# EAGLE design isolated io booster pack (EAGLE 6.4)
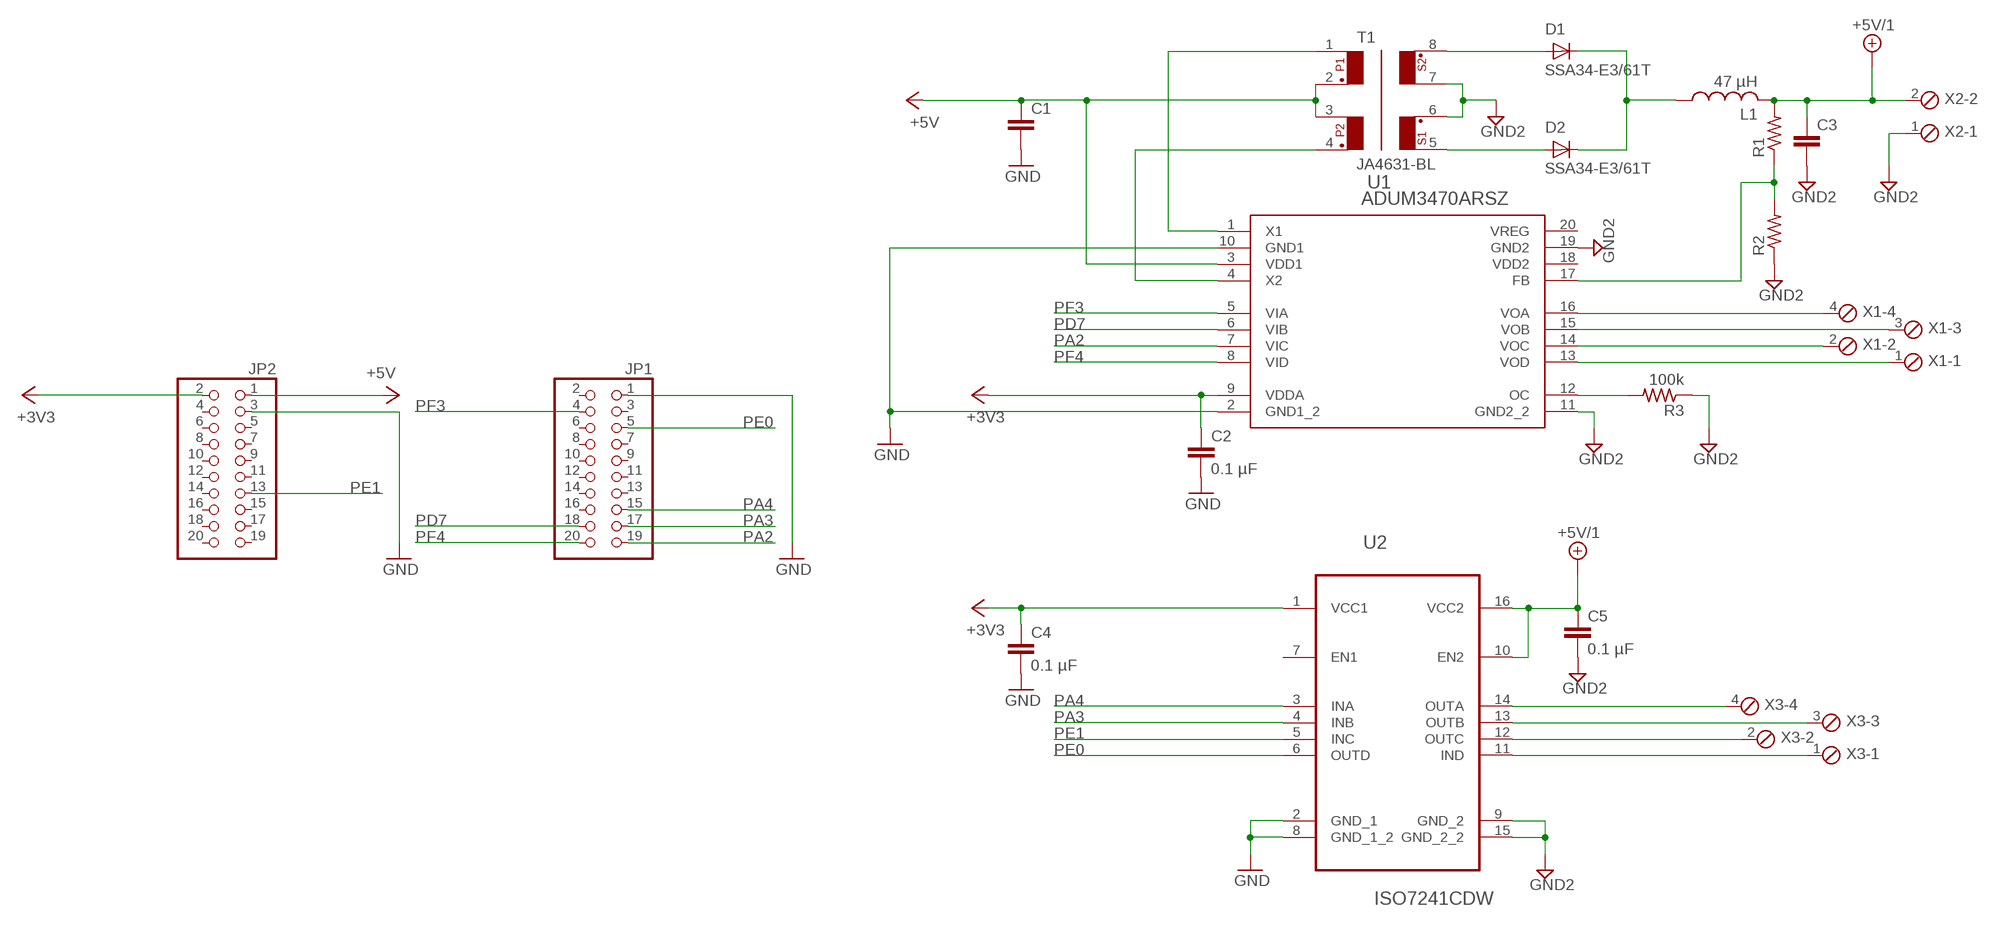
[diagram p0: schematic, sheet 1]

## Parts
C1  C-EUC1210  [C1210]
C2  0.1 µF  C-EUC0805  [C0805]
C3  C-EUC1210  [C1210]
C4  0.1 µF  C-EUC0805  [C0805]
C5  0.1 µF  C-EUC0805  [C0805]
D1  SSA34-E3/61T  GF1  [SMA-DO214AC]
D2  SSA34-E3/61T  GF1  [SMA-DO214AC]
JP1  PINHD-2X10  [2X10]
JP2  PINHD-2X10  [2X10]
L1  47 µH  L-USLPS5030  [LPS5030]
R1  R-US_R0805  [R0805]
R2  R-US_R0805  [R0805]
R3  100k  R-US_R0805  [R0805]
T1  JA4631-BL  [JA4631-BL]
U1  ADUM3470ARSZ  [RS_20]
U2  ISO7241CDW  [SOIC127P1030X265-16N]
X1  MPT4  [4POL254]
X2  MPT2  [2POL254]
X3  MPT4  [4POL254]

## Nets
+3V3: C2.1 C4.1 JP2.2 U1.9(VDDA) U2.1(VCC1)
+5V: C1.1 JP2.1 T1.2 T1.3 U1.3(VDD1)
+5V/1: C3.1 C5.1 L1.2 R1.2 U2.10(EN2) U2.16(VCC2) X2.2
GND: C1.2 C2.2 C4.2 JP1.1 JP2.3 U1.2(GND1_2) U1.10(GND1) U2.2(GND_1) U2.8(GND_1_2)
GND2: C3.2 C5.2 R2.1 R3.1 T1.6 T1.7 U1.11(GND2_2) U1.19(GND2) U2.9(GND_2) U2.15(GND_2_2) X2.1
N$1: U1.16(VOA) X1.4
N$2: D1.A T1.8
N$3: T1.1 U1.1(X1)
N$4: T1.4 U1.4(X2)
N$5: D2.A T1.5
N$6: D1.K(C) D2.K(C) L1.1
N$7: U1.15(VOB) X1.3
N$8: U1.14(VOC) X1.2
N$9: U1.13(VOD) X1.1
N$10: U2.14(OUTA) X3.4
N$11: U2.13(OUTB) X3.3
N$12: U2.12(OUTC) X3.2
N$13: U2.11(IND) X3.1
N$14: R1.1 R2.2 U1.17(FB)
N$15: R3.2 U1.12(OC)
PA2: JP1.19 U1.7(VIC)
PA3: JP1.17 U2.4(INB)
PA4: JP1.15 U2.3(INA)
PD7: JP1.18 U1.6(VIB)
PE0: JP1.5 U2.6(OUTD)
PE1: JP2.13 U2.5(INC)
PF3: JP1.4 U1.5(VIA)
PF4: JP1.20 U1.8(VID)
Unconnected: JP1.2 JP1.3 JP1.6 JP1.7 JP1.8 JP1.9 JP1.10 JP1.11 JP1.12 JP1.13 JP1.14 JP1.16 JP2.4 JP2.5 JP2.6 JP2.7 JP2.8 JP2.9 JP2.10 JP2.11 JP2.12 JP2.14 JP2.15 JP2.16 JP2.17 JP2.18 JP2.19 JP2.20 U1.18(VDD2) U1.20(VREG) U2.7(EN1)

## Library data of the parts
C1-C5 = rcl:C-EU: CAPACITOR, European symbol
D1 D2 = diode:GF1: DIODE
JP1 JP2 = pinhead:PINHD-2X10: PIN HEADER
L1 = inductors:L-US: INDUCTOR, American symbol
R1-R3 = rcl:R-US_: RESISTOR, American symbol
T1 = JA4631-BL:JA4631-BL
U1 = ADuM3470:ADUM3470ARSZ
U2 = ISO7241:ISO7241CDW: HIGH SPEED QUAD DIGITAL ISOLATORS; MPN: ISO7241CDW; OC_FARNELL: 1575372; OC_NEWARK: 73M3155; PACKAGE: SOIC-16; SUPPLIER: TEXAS INSTRUMENTS
X1 X3 = con-phoenix-254:MPT4: PHOENIX CONNECTOR; OC_FARNELL: unknown; OC_NEWARK: unknown
X2 = con-phoenix-254:MPT2: PHOENIX CONNECTOR; OC_FARNELL: unknown; OC_NEWARK: unknown

## Board
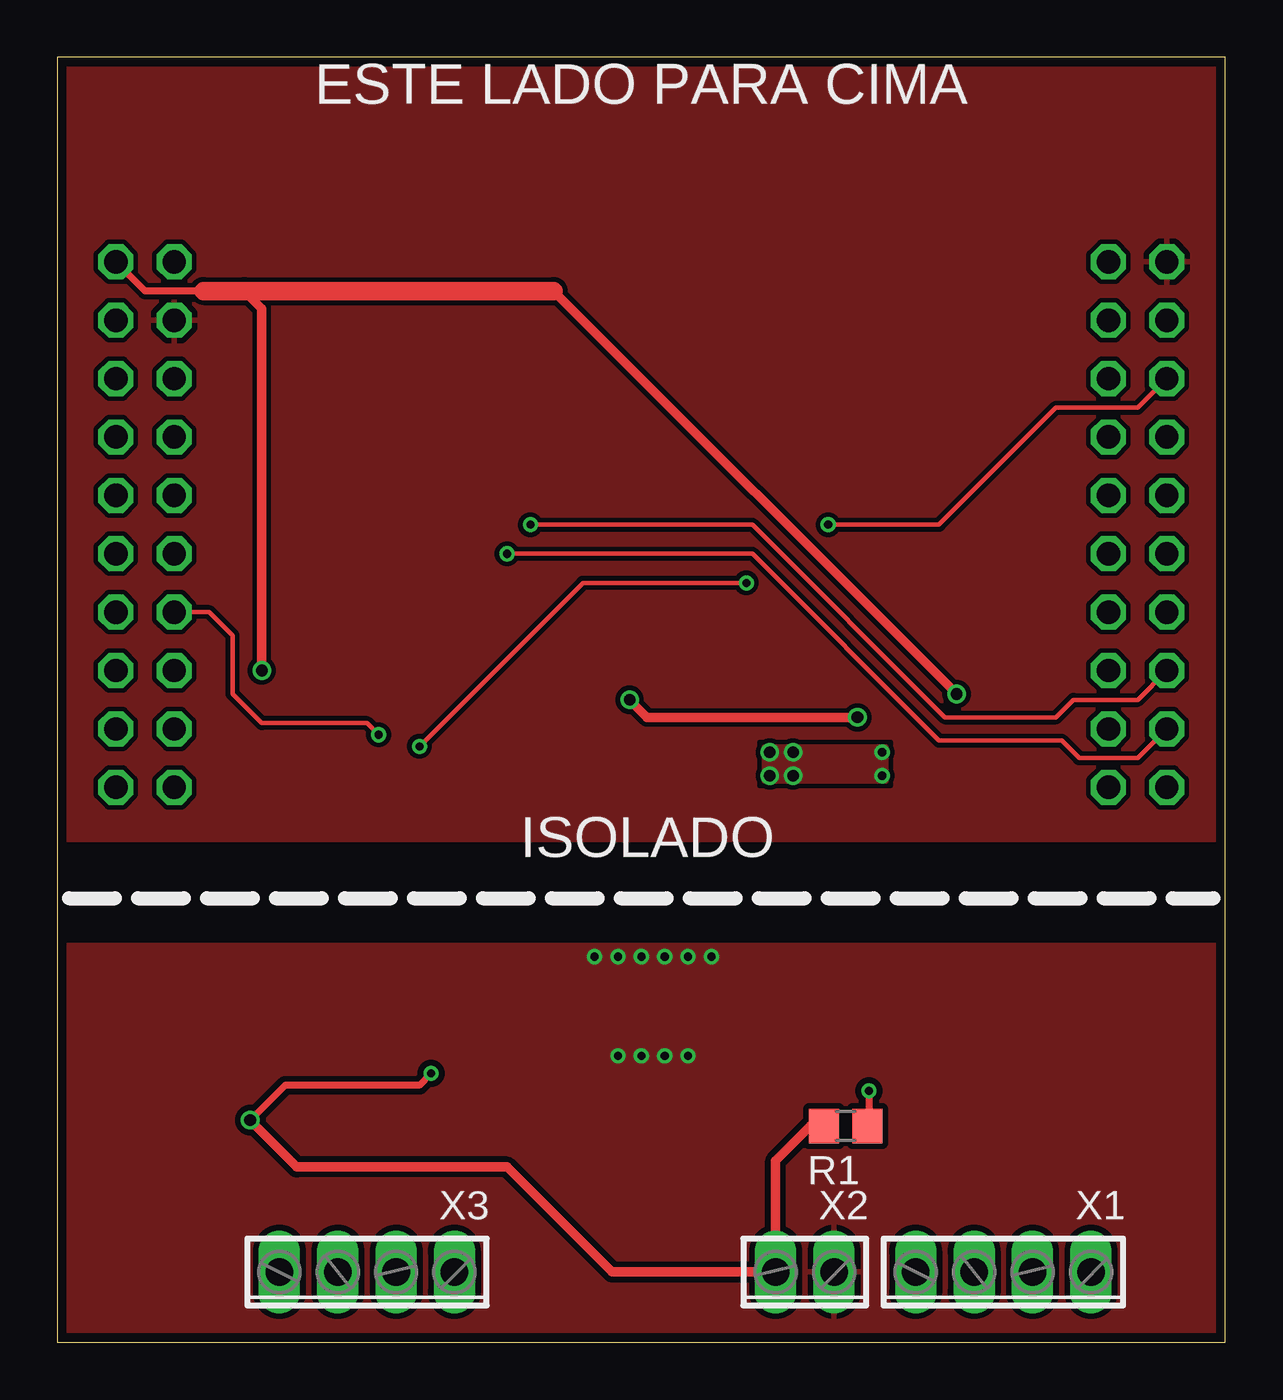
[diagram p1: board, top side]
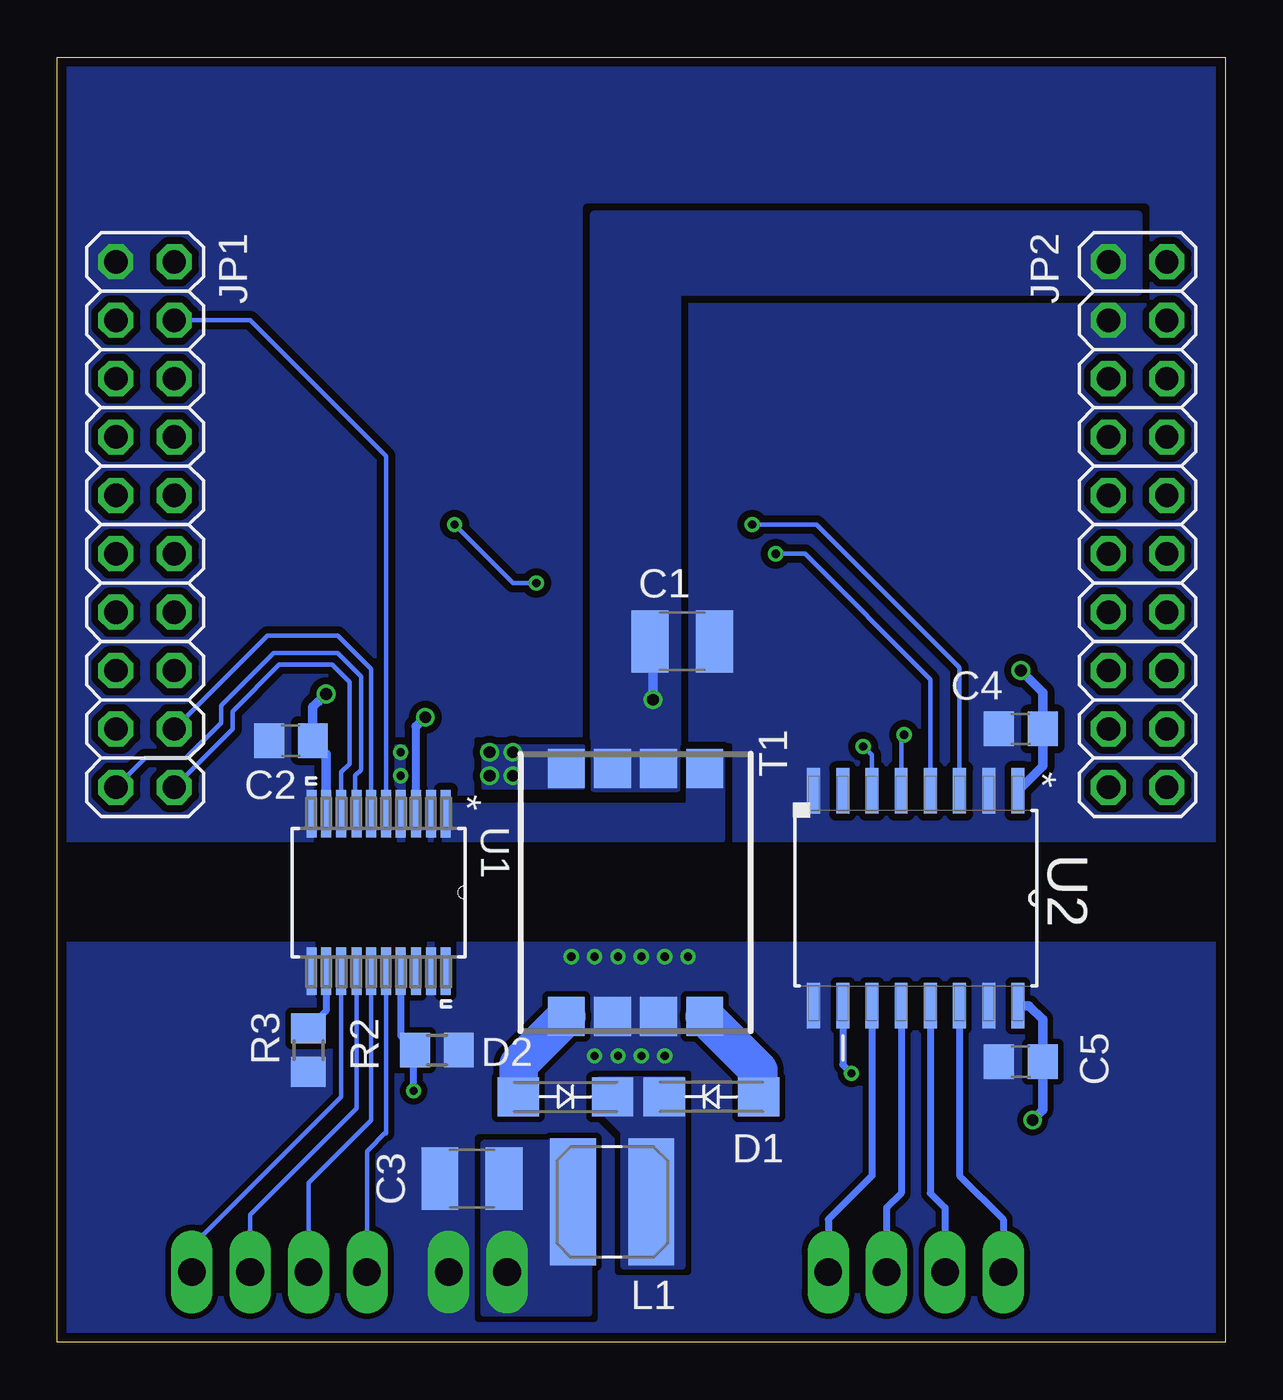
[diagram p2: board, bottom side, seen from below]

Size 50.8 x 55.88 mm. Coordinates in mm from the lower left corner, seen from the top.
Outline: 0,0 50.8,0 50.8,55.88 0,55.88 0,0
Copper layers (1*16): Top 0.035mm / dielectric 1.5mm / Bottom 0.035mm
Design rules "Fusion_eagle_rule_v1.1 *": minimum track width 6mil, minimum drill 12mil, track to track 6mil, track to pad 6mil, pad to pad 6mil, via to via 6mil, smd to smd 0mil, copper to edge 16mil, drill to drill 10mil, minimum pad ring 10mil, minimum via ring 6mil, stop-mask expansion 2mil, vias tented up to drill 100mil, thermal gap 10mil

### Footprints (pad centres in the part's own frame; a part is rotated, then mirrored left to right if it is on the bottom)
C1210 = smd 1.6 x 2.7: 1 -1.4,0; 2 1.4,0
C0805 = smd 1.3 x 1.5: 1 -0.95,0; 2 0.95,0
SMA-DO214AC = smd 1.8 x 1.7: A -2.05,0; K 2.05,0
2X10 = drill 1.016 octagon: 1 -11.43,-1.27; 2 -11.43,1.27; 3 -8.89,-1.27; 4 -8.89,1.27; 5 -6.35,-1.27; 6 -6.35,1.27; 7 -3.81,-1.27; 8 -3.81,1.27; 9 -1.27,-1.27; 10 -1.27,1.27; 11 1.27,-1.27; 12 1.27,1.27; 13 3.81,-1.27; 14 3.81,1.27; 15 6.35,-1.27; 16 6.35,1.27; 17 8.89,-1.27; 18 8.89,1.27; 19 11.43,-1.27; 20 11.43,1.27
LPS5030 = smd 1.995 x 5.51: 1 -1.7,0; 2 1.7,0
R0805 = smd 1.3 x 1.5: 1 -0.95,0; 2 0.95,0
JA4631-BL = smd 1.702 x 1.6: 1 -5.397,3.01; 2 -5.397,1.003; 3 -5.397,-1.003; 4 -5.397,-3.01; 5 5.397,-3.01; 6 5.397,-1.003; 7 5.397,1.003; 8 5.397,3.01
RS_20 = smd 2.057 x 0.432: 1 -3.429,2.921; 2 -3.429,2.286; 3 -3.429,1.626; 4 -3.429,0.965; 5 -3.429,0.33; 6 -3.429,-0.33; 7 -3.429,-0.965; 8 -3.429,-1.626; 9 -3.429,-2.286; 10 -3.429,-2.921; 11 3.429,-2.921; 12 3.429,-2.286; 13 3.429,-1.626; 14 3.429,-0.965; 15 3.429,-0.33; 16 3.429,0.33; 17 3.429,0.965; 18 3.429,1.626; 19 3.429,2.286; 20 3.429,2.921
SOIC127P1030X265-16N = smd 1.981 x 0.559: 1 -4.674,4.445; 2 -4.674,3.175; 3 -4.674,1.905; 4 -4.674,0.635; 5 -4.674,-0.635; 6 -4.674,-1.905; 7 -4.674,-3.175; 8 -4.674,-4.445; 9 4.674,-4.445; 10 4.674,-3.175; 11 4.674,-1.905; 12 4.674,-0.635; 13 4.674,0.635; 14 4.674,1.905; 15 4.674,3.175; 16 4.674,4.445
4POL254 = drill 1.2 long: 1 -3.81,0; 2 -1.27,0; 3 1.27,0; 4 3.81,0
2POL254 = drill 1.2 long: 1 -1.27,0; 2 1.27,0

### Placement (x,y rotation side)
C1  23.62,30.48 0 bottom
C2  40.64,26.16 180 bottom
C3  32.77,7.11 180 bottom
C4  8.89,26.67 180 bottom
C5  8.89,12.19 180 bottom
D1  22.35,10.67 180 bottom
D2  28.7,10.67 0 bottom
JP1  46.99,35.56 270 bottom
JP2  3.81,35.56 270 bottom
L1  26.67,6.1 180 bottom
R1  34.29,9.4 180 top
R2  34.29,12.7 180 bottom
R3  39.88,12.7 90 bottom
T1  25.65,19.56 270 bottom
U1  36.83,19.56 270 bottom
U2  13.46,19.3 270 bottom
X1  41.15,3.05 180 top
X2  32.51,3.05 180 top
X3  13.46,3.05 180 top

### Tracks (layer width: path | path; a pad name or v marks a point on that pad's centre or on a via)
+3V3  (via drill 0.51)
  Top 0.305: 6.35,45.72 3.81,45.72 JP2.2
  Top 0.406: v39.12,28.19 21.59,45.72 | v8.89,29.21 8.89,44.96 8.13,45.72
  Top 0.813: 6.35,45.72 8.13,45.72 21.59,45.72
  Bottom 0.406: 39.44,27.87 v39.12,28.19 39.69,27.62 C2.1 39.12,25.59 U1.9 | U2.1 7.94,25.05 C4.1 7.94,28.26 v8.89,29.21
+5V  (via drill 0.51)
  Top 0.406: v34.8,27.18 25.65,27.18 v24.89,27.94
  Bottom 0.356: U1.3 35.2,26.77
  Bottom 0.406: 35.2,26.77 v34.8,27.18 | v24.89,27.94 24.89,29.46
  pour Bottom (isolate 0.254, rank 2, no thermals): 27.43,24.13 27.43,49.02 3.81,49.02 3.81,45.72 23.88,45.72 23.88,24.13
+5V/1  (via drill 0.36, 0.51)
  Top 0.305: v8.38,9.65 9.91,11.18 15.75,11.18 v16.26,11.68
  Top 0.406: v8.38,9.65 10.41,7.62 19.56,7.62 24.13,3.05 X2.2 31.24,7.87 32.77,9.4 R1.2
  Bottom 0.305: U2.10 16.64,12.06 v16.26,11.68
  Bottom 0.406: U2.16 8.53,14.63 7.94,14.04 C5.1 7.94,10.09 v8.38,9.65
  pour Bottom (isolate 0.254, no thermals): 27.69,8.64 32.26,8.64 32.26,1.27 27.69,1.27
GND
  pour Top (isolate 0.203, rank 6): 0,21.84 50.8,21.84 50.8,55.88 0,55.88
  pour Bottom (isolate 0.305, rank 6, no thermals): 0,21.84 50.8,21.84 50.8,55.88 0,55.88
GND2  (via drill 0.36)
  other vias: 23.37,16.76 24.38,16.76 25.4,16.76 26.42,16.76 27.43,16.76 28.45,16.76 24.38,12.45 25.4,12.45 26.42,12.45 27.43,12.45
  pour Top (isolate 0.254, rank 6): 0,0 50.8,0 50.8,17.02 50.8,17.27 0,17.27
  pour Bottom (isolate 0.254, rank 6, no thermals): 0,0 50.8,0 50.8,17.02 50.8,17.27 0,17.27
N$1
  Bottom 0.203: U1.16 36.5,9.14 | 36.5,9.14 36.5,9.07 | X1.4 37.34,8.31 36.5,9.14
N$2
  Bottom 1.422: 22.61,14.12 T1.8
  Bottom 1.676: D1.A 20.3,11.82 T1.8
N$3
  pour Bottom (isolate 0.254, no thermals): 21.84,25.65 23.37,25.65 23.37,23.37 34.04,23.37 34.04,21.84 21.84,21.84
N$4  (via drill 0.36, 0.51)
  other vias: 35.88,24.64 35.88,25.65 30.99,25.65 30.99,24.64 32,25.65 32,24.64
  pour Bottom (isolate 0.254, no thermals): 35.56,21.84 35.56,25.91 36.07,25.91 36.07,21.84
  pour Top (isolate 0.254): 36.07,24.38 30.73,24.38 30.73,25.91 36.07,25.91
  pour Bottom (isolate 0.254, no thermals): 32.26,24.13 27.94,24.13 27.94,25.91 32.26,25.91
N$5
  Bottom 1.422: 28.7,14.12 T1.5
  Bottom 1.676: D2.A 30.75,12.07 T1.5
N$6
  pour Bottom (isolate 0.254, no thermals): 27.18,10.16 27.18,11.43 23.62,11.43 23.62,3.3 26.16,3.3 26.16,9.14
N$7
  Bottom 0.203: U1.15 37.16,9.65 39.88,6.93 X1.3
N$8
  Bottom 0.203: U1.14 37.8,10.16 42.42,5.54 X1.2
N$9
  Bottom 0.203: U1.13 38.46,10.67 44.96,4.17 X1.1
N$10
  Bottom 0.305: U2.14 11.56,7.24 9.65,5.33 X3.4
N$11
  Bottom 0.305: U2.13 12.83,6.48 12.19,5.84 X3.3
N$12
  Bottom 0.305: U2.12 14.1,6.48 14.73,5.84 X3.2
N$13
  Bottom 0.305: U2.11 15.37,7.24 17.27,5.33 X3.1
N$14  (via drill 0.36)
  Top 0.305: v35.31,10.92 35.31,9.46 R1.1
  Bottom 0.305: U1.17 35.87,13.32 R2.2 35.31,12.63 v35.31,10.92
N$15
  Bottom 0.305: U1.12 39.12,14.41 R3.2
PA2
  Bottom 0.203: U1.7 37.85,23.04 37.85,24.64 37.59,24.89 37.59,28.96 38.61,29.97 41.4,29.97 43.69,27.69 43.69,26.92 45.21,25.4 46.99,25.4 JP1.19
PA3  (via drill 0.36)
  Top 0.203: v19.56,34.29 30.23,34.29 38.35,26.16 43.69,26.16 44.45,25.4 46.99,25.4 JP1.17
  Bottom 0.203: U2.4 12.83,28.83 18.29,34.29 v19.56,34.29
PA4  (via drill 0.36)
  Top 0.203: v20.57,35.56 30.23,35.56 38.61,27.18 43.43,27.18 44.2,27.94 46.99,27.94 JP1.15
  Bottom 0.203: U2.3 11.56,29.34 17.78,35.56 v20.57,35.56
PD7
  Bottom 0.203: U1.6 37.16,29.29 38.61,30.73 41.66,30.73 JP1.18
PE0  (via drill 0.36)
  Top 0.203: JP1.5 46.99,40.64 43.43,40.64 38.35,35.56 v33.53,35.56 | v29.97,33.02 22.86,33.02 v15.75,25.91
  Bottom 0.203: U2.6 15.37,25.53 v15.75,25.91 | v29.97,33.02 30.99,33.02 v33.53,35.56
PE1  (via drill 0.36)
  Top 0.203: v13.97,26.42 13.46,26.92 8.89,26.92 7.62,28.19 7.62,30.73 6.6,31.75 JP2.13
  Bottom 0.203: U2.5 14.1,26.29 v13.97,26.42
PF3
  Bottom 0.203: U1.5 36.5,38.53 42.42,44.45 JP1.4
PF4
  Bottom 0.203: U1.8 38.46,24.79 38.1,25.15 38.1,28.7 38.86,29.46 41.15,29.46 43.18,27.43 43.18,26.67 JP1.20

### Text on the board
tPlace: ESTE LADO PARA CIMA | ISOLADO